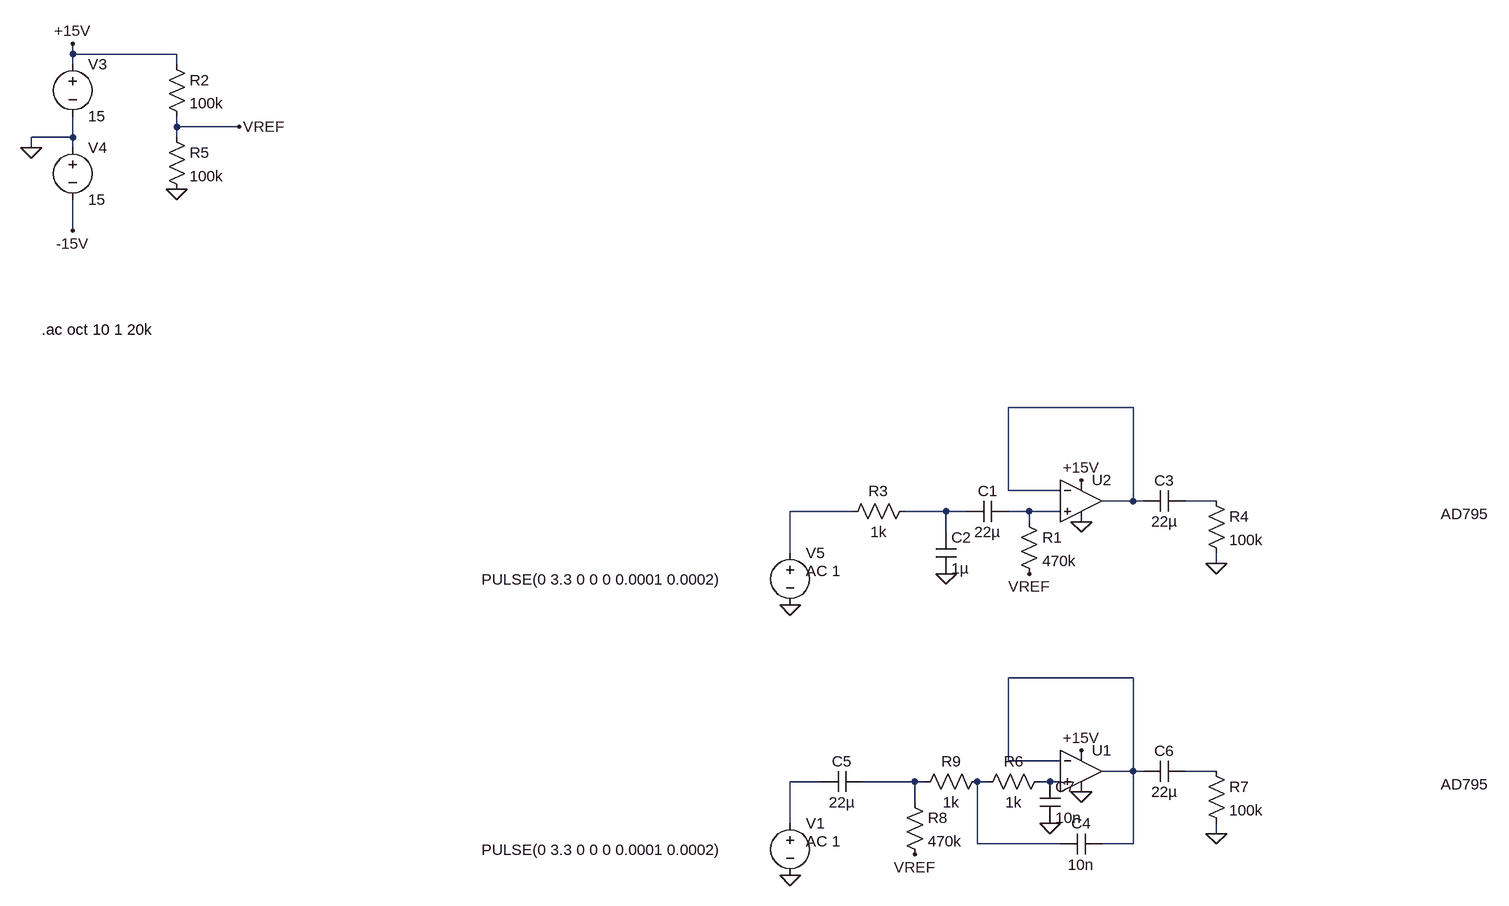
[diagram p0: schematic LPF.asc]
LPF.asc, the LTspice schematic file:
Version 4
SHEET 1 1688 1336
WIRE -496 0 -496 -16
WIRE -336 0 -496 0
WIRE -496 16 -496 0
WIRE -336 16 -336 0
WIRE -336 112 -336 96
WIRE -240 112 -336 112
WIRE -496 128 -496 96
WIRE -496 128 -560 128
WIRE -336 128 -336 112
WIRE -560 144 -560 128
WIRE -496 144 -496 128
WIRE -496 272 -496 224
WIRE 1136 544 944 544
WIRE 944 672 944 544
WIRE 1024 672 944 672
WIRE 1136 688 1136 544
WIRE 1136 688 1088 688
WIRE 1152 688 1136 688
WIRE 1264 688 1216 688
WIRE 704 704 608 704
WIRE 848 704 784 704
WIRE 880 704 848 704
WIRE 976 704 944 704
WIRE 1024 704 976 704
WIRE 976 720 976 704
WIRE 848 736 848 704
WIRE 608 768 608 704
WIRE 1264 784 1264 768
WIRE 1136 960 944 960
WIRE 944 1088 944 960
WIRE 1024 1088 944 1088
WIRE 1136 1104 1136 960
WIRE 1136 1104 1088 1104
WIRE 1152 1104 1136 1104
WIRE 1264 1104 1216 1104
WIRE 656 1120 608 1120
WIRE 800 1120 720 1120
WIRE 816 1120 800 1120
WIRE 912 1120 896 1120
WIRE 1008 1120 992 1120
WIRE 1024 1120 1008 1120
WIRE 800 1152 800 1120
WIRE 608 1184 608 1120
WIRE 1264 1200 1264 1184
WIRE 896 1216 896 1120
WIRE 1024 1216 896 1216
WIRE 1136 1216 1136 1104
WIRE 1136 1216 1088 1216
FLAG -560 144 0
FLAG -496 -16 +15V
FLAG -496 272 -15V
FLAG 608 848 0
FLAG 1056 656 +15V
FLAG 848 800 0
FLAG 1264 784 0
FLAG 1056 720 0
FLAG -336 208 0
FLAG -240 112 VREF
FLAG 976 800 VREF
FLAG 608 1264 0
FLAG 1056 1072 +15V
FLAG 1264 1200 0
FLAG 1056 1136 0
FLAG 800 1232 VREF
FLAG 1008 1184 0
SYMBOL voltage -496 0 R0
WINDOW 123 0 0 Left 0
WINDOW 39 0 0 Left 0
SYMATTR InstName V3
SYMATTR Value 15
SYMBOL voltage -496 128 R0
WINDOW 123 0 0 Left 0
WINDOW 39 0 0 Left 0
SYMATTR InstName V4
SYMATTR Value 15
SYMBOL voltage 608 752 R0
WINDOW 3 -475 57 Left 2
WINDOW 123 24 44 Left 2
WINDOW 39 0 0 Left 0
SYMATTR Value PULSE(0 3.3 0 0 0 0.0001 0.0002)
SYMATTR Value2 AC 1
SYMATTR InstName V5
SYMBOL Opamps\\AD795 1056 624 R0
WINDOW 3 553 84 Left 2
SYMATTR InstName U2
SYMBOL cap 832 736 R0
SYMATTR InstName C2
SYMATTR Value 1µ
SYMBOL res 800 688 R90
WINDOW 0 0 56 VBottom 2
WINDOW 3 32 56 VTop 2
SYMATTR InstName R3
SYMATTR Value 1k
SYMBOL res 1248 672 R0
SYMATTR InstName R4
SYMATTR Value 100k
SYMBOL res 960 704 R0
SYMATTR InstName R1
SYMATTR Value 470k
SYMBOL res -352 0 R0
SYMATTR InstName R2
SYMATTR Value 100k
SYMBOL res -352 112 R0
SYMATTR InstName R5
SYMATTR Value 100k
SYMBOL cap 944 688 R90
WINDOW 0 0 32 VBottom 2
WINDOW 3 32 32 VTop 2
SYMATTR InstName C1
SYMATTR Value 22µ
SYMBOL cap 1216 672 R90
WINDOW 0 0 32 VBottom 2
WINDOW 3 32 32 VTop 2
SYMATTR InstName C3
SYMATTR Value 22µ
SYMBOL voltage 608 1168 R0
WINDOW 3 -475 57 Left 2
WINDOW 123 24 44 Left 2
WINDOW 39 0 0 Left 0
SYMATTR Value PULSE(0 3.3 0 0 0 0.0001 0.0002)
SYMATTR Value2 AC 1
SYMATTR InstName V1
SYMBOL Opamps\\AD795 1056 1040 R0
WINDOW 3 553 84 Left 2
SYMATTR InstName U1
SYMBOL res 1248 1088 R0
SYMATTR InstName R7
SYMATTR Value 100k
SYMBOL res 784 1136 R0
SYMATTR InstName R8
SYMATTR Value 470k
SYMBOL cap 720 1104 R90
WINDOW 0 0 32 VBottom 2
WINDOW 3 32 32 VTop 2
SYMATTR InstName C5
SYMATTR Value 22µ
SYMBOL cap 1216 1088 R90
WINDOW 0 0 32 VBottom 2
WINDOW 3 32 32 VTop 2
SYMATTR InstName C6
SYMATTR Value 22µ
SYMBOL cap 1088 1200 R90
WINDOW 0 0 32 VBottom 2
WINDOW 3 32 32 VTop 2
SYMATTR InstName C4
SYMATTR Value 10n
SYMBOL res 1008 1104 R90
WINDOW 0 0 56 VBottom 2
WINDOW 3 32 56 VTop 2
SYMATTR InstName R6
SYMATTR Value 1k
SYMBOL res 912 1104 R90
WINDOW 0 0 56 VBottom 2
WINDOW 3 32 56 VTop 2
SYMATTR InstName R9
SYMATTR Value 1k
SYMBOL cap 992 1120 R0
SYMATTR InstName C7
SYMATTR Value 10n
TEXT -544 424 Left 2 !.ac oct 10 1 20k

The netlist it stands for:
* LPF.asc
V3 +15V 0 15
V4 0 -15V 15
V5 N003 0 PULSE(0 3.3 0 0 0 0.0001 0.0002) AC 1
XU2 N005 N001 +15V 0 N001 AD795  ; pins In+ In- V+ V- OUT
C2 N004 0 1µ
R3 N004 N003 1k
R4 N002 0 100k
R1 N005 VREF 470k
R2 +15V VREF 100k
R5 VREF 0 100k
C1 N005 N004 22µ
C3 N002 N001 22µ
V1 N008 0 PULSE(0 3.3 0 0 0 0.0001 0.0002) AC 1
XU1 N011 N006 +15V 0 N006 AD795  ; pins In+ In- V+ V- OUT
R7 N007 0 100k
R8 N009 VREF 470k
C5 N009 N008 22µ
C6 N007 N006 22µ
C4 N006 N010 10n
R6 N011 N010 1k
R9 N010 N009 1k
C7 N011 0 10n
.ac oct 10 1 20k
.lib ADI1.lib
.backanno
.end